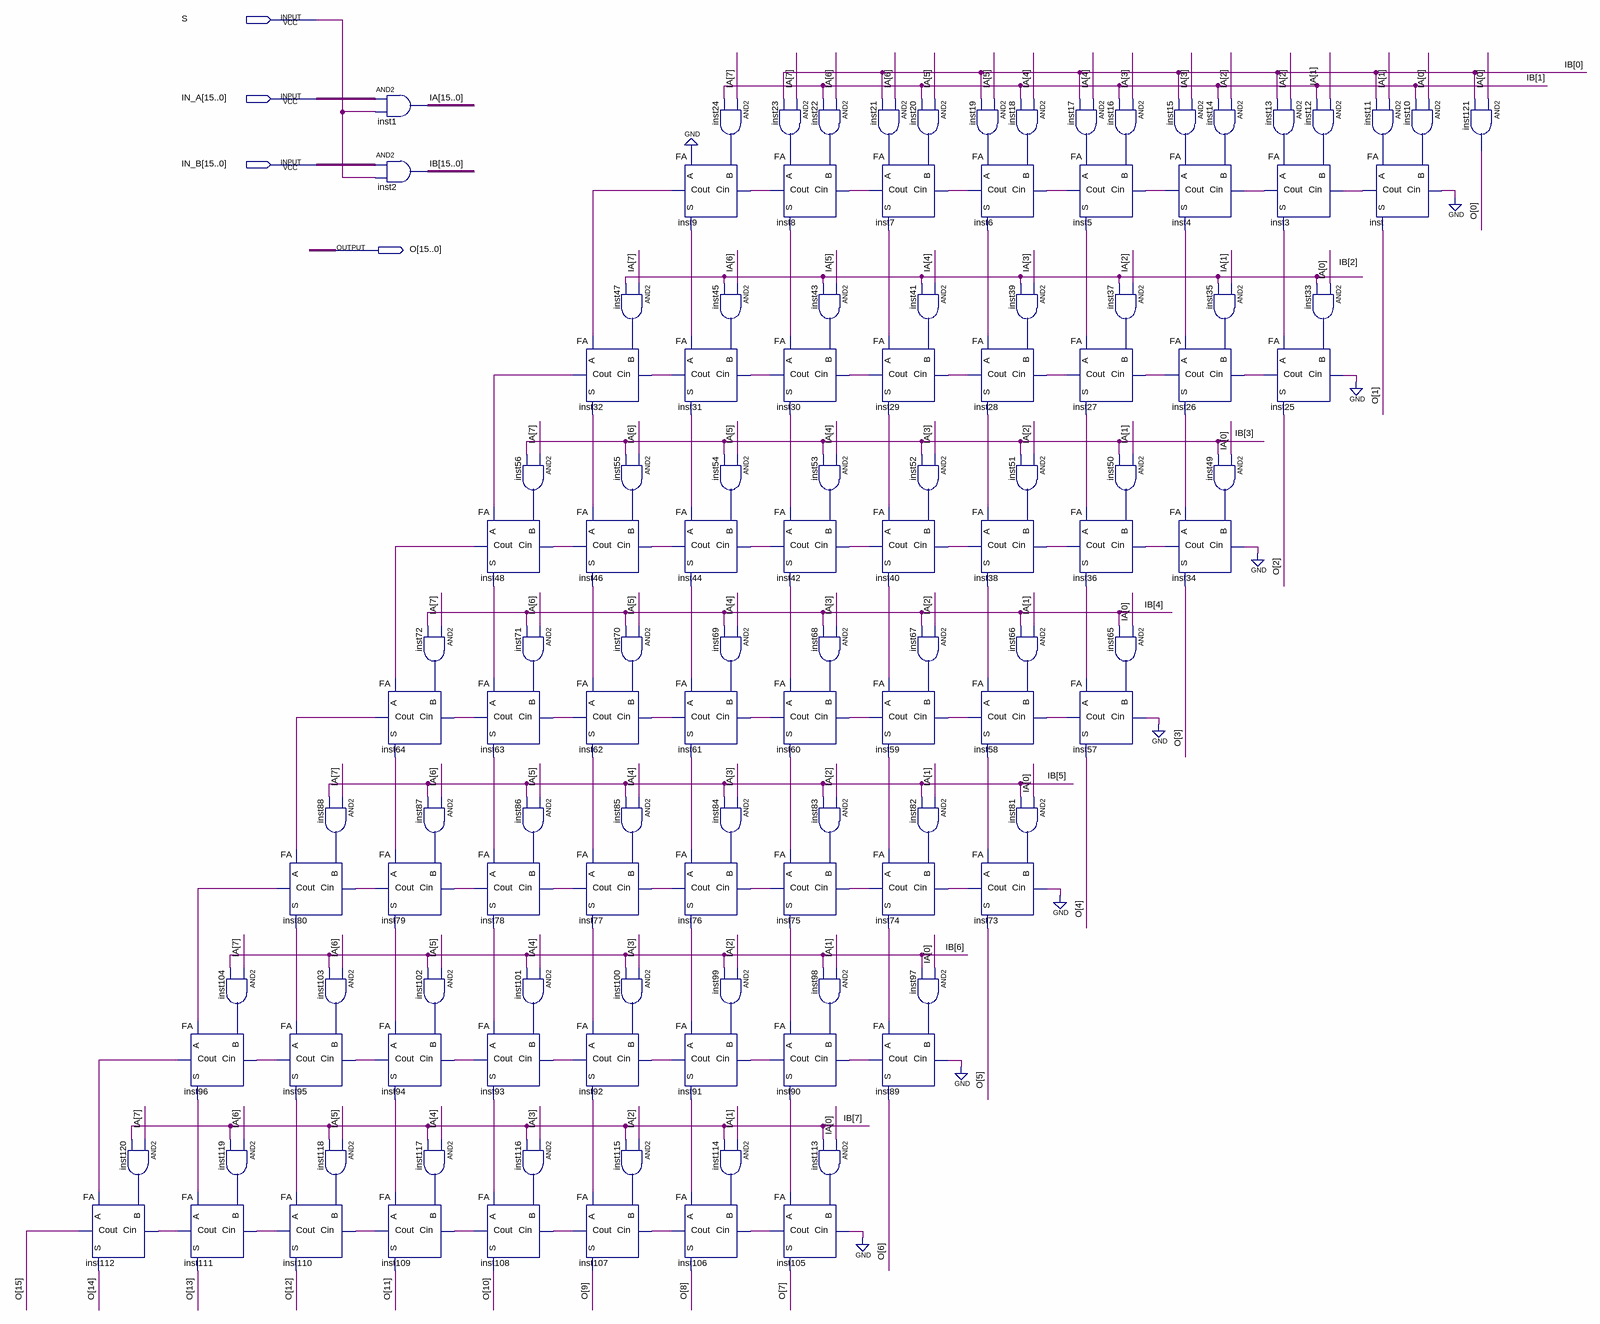
[diagram p0: schematic sheet]
// Quartus schematic Multiplier.bdf as structural Verilog: 122 symbols, 4 pins
module Multiplier (
  input  S,
  input  [15:0] IN_A,
  input  [15:0] IN_B,
  output [15:0] O
);

  wire inst3_cout, inst3_s, inst4_cout, inst4_s, inst5_cout, inst5_s, inst6_cout, inst6_s, inst7_cout,
       inst7_s, inst8_cout, inst8_s, inst9_cout, inst9_s, inst10_out, inst11_out, inst12_out, inst13_out,
       inst14_out, inst15_out, inst16_out, inst17_out, inst18_out, inst19_out, inst20_out, inst21_out,
       inst22_out, inst23_out, inst24_out, inst25_cout, inst26_cout, inst26_s, inst27_cout, inst27_s,
       inst28_cout, inst28_s, inst29_cout, inst29_s, inst30_cout, inst30_s, inst31_cout, inst31_s,
       inst32_cout, inst32_s, inst33_out, inst34_cout, inst35_out, inst36_cout, inst36_s, inst37_out,
       inst38_cout, inst38_s, inst39_out, inst40_cout, inst40_s, inst41_out, inst42_cout, inst42_s,
       inst43_out, inst44_cout, inst44_s, inst45_out, inst46_cout, inst46_s, inst47_out, inst48_cout,
       inst48_s, inst49_out, inst50_out, inst51_out, inst52_out, inst53_out, inst54_out, inst55_out,
       inst56_out, inst57_cout, inst58_cout, inst58_s, inst59_cout, inst59_s, inst60_cout, inst60_s,
       inst61_cout, inst61_s, inst62_cout, inst62_s, inst63_cout, inst63_s, inst64_cout, inst64_s,
       inst65_out, inst66_out, inst67_out, inst68_out, inst69_out, inst70_out, inst71_out, inst72_out,
       inst73_cout, inst74_cout, inst74_s, inst75_cout, inst75_s, inst76_cout, inst76_s, inst77_cout,
       inst77_s, inst78_cout, inst78_s, inst79_cout, inst79_s, inst80_cout, inst80_s, inst81_out, inst82_out,
       inst83_out, inst84_out, inst85_out, inst86_out, inst87_out, inst88_out, inst89_cout, inst90_cout,
       inst90_s, inst91_cout, inst91_s, inst92_cout, inst92_s, inst93_cout, inst93_s, inst94_cout, inst94_s,
       inst95_cout, inst95_s, inst96_cout, inst96_s, inst97_out, inst98_out, inst99_out, inst100_out,
       inst101_out, inst102_out, inst103_out, inst104_out, inst105_cout, inst106_cout, inst107_cout,
       inst108_cout, inst109_cout, inst110_cout, inst111_cout, inst113_out, inst114_out, inst115_out,
       inst116_out, inst117_out, inst118_out, inst119_out, inst120_out, inst_cout;
  wire [15:0] IA, IB;

  and inst120 (inst120_out, IA[7], IB[7]);
  FA inst112 (.A(inst96_cout), .B(inst120_out), .Cin(inst111_cout), .S(O[14]), .Cout(O[15]));
  and inst104 (inst104_out, IA[7], IB[6]);
  FA inst96 (.A(inst80_cout), .B(inst104_out), .Cin(inst95_cout), .S(inst96_s), .Cout(inst96_cout));
  and inst119 (inst119_out, IA[6], IB[7]);
  FA inst111 (.A(inst96_s), .B(inst119_out), .Cin(inst110_cout), .S(O[13]), .Cout(inst111_cout));
  FA inst80 (.A(inst64_cout), .B(inst88_out), .Cin(inst79_cout), .S(inst80_s), .Cout(inst80_cout));
  FA inst95 (.A(inst80_s), .B(inst103_out), .Cin(inst94_cout), .S(inst95_s), .Cout(inst95_cout));
  FA inst110 (.A(inst95_s), .B(inst118_out), .Cin(inst109_cout), .S(O[12]), .Cout(inst110_cout));
  and inst88 (inst88_out, IA[7], IB[5]);
  and inst103 (inst103_out, IA[6], IB[6]);
  and inst118 (inst118_out, IA[5], IB[7]);
  assign IA = IN_A & {16{S}};  // AND2 inst1, 16 bits wide
  assign IB = IN_B & {16{S}};  // AND2 inst2, 16 bits wide
  FA inst64 (.A(inst48_cout), .B(inst72_out), .Cin(inst63_cout), .S(inst64_s), .Cout(inst64_cout));
  FA inst79 (.A(inst64_s), .B(inst87_out), .Cin(inst78_cout), .S(inst79_s), .Cout(inst79_cout));
  FA inst94 (.A(inst79_s), .B(inst102_out), .Cin(inst93_cout), .S(inst94_s), .Cout(inst94_cout));
  FA inst109 (.A(inst94_s), .B(inst117_out), .Cin(inst108_cout), .S(O[11]), .Cout(inst109_cout));
  and inst72 (inst72_out, IA[7], IB[4]);
  and inst87 (inst87_out, IA[6], IB[5]);
  and inst102 (inst102_out, IA[5], IB[6]);
  and inst117 (inst117_out, IA[4], IB[7]);
  FA inst48 (.A(inst32_cout), .B(inst56_out), .Cin(inst46_cout), .S(inst48_s), .Cout(inst48_cout));
  FA inst63 (.A(inst48_s), .B(inst71_out), .Cin(inst62_cout), .S(inst63_s), .Cout(inst63_cout));
  FA inst78 (.A(inst63_s), .B(inst86_out), .Cin(inst77_cout), .S(inst78_s), .Cout(inst78_cout));
  FA inst93 (.A(inst78_s), .B(inst101_out), .Cin(inst92_cout), .S(inst93_s), .Cout(inst93_cout));
  FA inst108 (.A(inst93_s), .B(inst116_out), .Cin(inst107_cout), .S(O[10]), .Cout(inst108_cout));
  and inst56 (inst56_out, IA[7], IB[3]);
  and inst71 (inst71_out, IA[6], IB[4]);
  and inst86 (inst86_out, IA[5], IB[5]);
  and inst101 (inst101_out, IA[4], IB[6]);
  and inst116 (inst116_out, IA[3], IB[7]);
  FA inst32 (.A(inst9_cout), .B(inst47_out), .Cin(inst31_cout), .S(inst32_s), .Cout(inst32_cout));
  FA inst46 (.A(inst32_s), .B(inst55_out), .Cin(inst44_cout), .S(inst46_s), .Cout(inst46_cout));
  FA inst62 (.A(inst46_s), .B(inst70_out), .Cin(inst61_cout), .S(inst62_s), .Cout(inst62_cout));
  FA inst77 (.A(inst62_s), .B(inst85_out), .Cin(inst76_cout), .S(inst77_s), .Cout(inst77_cout));
  FA inst92 (.A(inst77_s), .B(inst100_out), .Cin(inst91_cout), .S(inst92_s), .Cout(inst92_cout));
  FA inst107 (.A(inst92_s), .B(inst115_out), .Cin(inst106_cout), .S(O[9]), .Cout(inst107_cout));
  and inst47 (inst47_out, IA[7], IB[2]);
  and inst55 (inst55_out, IA[6], IB[3]);
  and inst70 (inst70_out, IA[5], IB[4]);
  and inst85 (inst85_out, IA[4], IB[5]);
  and inst100 (inst100_out, IA[3], IB[6]);
  and inst115 (inst115_out, IA[2], IB[7]);
  FA inst9 (.A(1'b0), .B(inst24_out), .Cin(inst8_cout), .S(inst9_s), .Cout(inst9_cout));
  FA inst31 (.A(inst9_s), .B(inst45_out), .Cin(inst30_cout), .S(inst31_s), .Cout(inst31_cout));
  FA inst44 (.A(inst31_s), .B(inst54_out), .Cin(inst42_cout), .S(inst44_s), .Cout(inst44_cout));
  FA inst61 (.A(inst44_s), .B(inst69_out), .Cin(inst60_cout), .S(inst61_s), .Cout(inst61_cout));
  FA inst76 (.A(inst61_s), .B(inst84_out), .Cin(inst75_cout), .S(inst76_s), .Cout(inst76_cout));
  FA inst91 (.A(inst76_s), .B(inst99_out), .Cin(inst90_cout), .S(inst91_s), .Cout(inst91_cout));
  FA inst106 (.A(inst91_s), .B(inst114_out), .Cin(inst105_cout), .S(O[8]), .Cout(inst106_cout));
  and inst24 (inst24_out, IA[7], IB[1]);
  and inst45 (inst45_out, IA[6], IB[2]);
  and inst54 (inst54_out, IA[5], IB[3]);
  and inst69 (inst69_out, IA[4], IB[4]);
  and inst84 (inst84_out, IA[3], IB[5]);
  and inst99 (inst99_out, IA[2], IB[6]);
  and inst114 (inst114_out, IA[1], IB[7]);
  and inst23 (inst23_out, IA[7], IB[0]);
  FA inst8 (.A(inst23_out), .B(inst22_out), .Cin(inst7_cout), .S(inst8_s), .Cout(inst8_cout));
  FA inst30 (.A(inst8_s), .B(inst43_out), .Cin(inst29_cout), .S(inst30_s), .Cout(inst30_cout));
  FA inst42 (.A(inst30_s), .B(inst53_out), .Cin(inst40_cout), .S(inst42_s), .Cout(inst42_cout));
  FA inst60 (.A(inst42_s), .B(inst68_out), .Cin(inst59_cout), .S(inst60_s), .Cout(inst60_cout));
  FA inst75 (.A(inst60_s), .B(inst83_out), .Cin(inst74_cout), .S(inst75_s), .Cout(inst75_cout));
  FA inst90 (.A(inst75_s), .B(inst98_out), .Cin(inst89_cout), .S(inst90_s), .Cout(inst90_cout));
  FA inst105 (.A(inst90_s), .B(inst113_out), .Cin(1'b0), .S(O[7]), .Cout(inst105_cout));
  and inst22 (inst22_out, IA[6], IB[1]);
  and inst43 (inst43_out, IA[5], IB[2]);
  and inst53 (inst53_out, IA[4], IB[3]);
  and inst68 (inst68_out, IA[3], IB[4]);
  and inst83 (inst83_out, IA[2], IB[5]);
  and inst98 (inst98_out, IA[1], IB[6]);
  and inst113 (inst113_out, IA[0], IB[7]);
  and inst20 (inst20_out, IA[5], IB[1]);
  and inst21 (inst21_out, IA[6], IB[0]);
  FA inst7 (.A(inst21_out), .B(inst20_out), .Cin(inst6_cout), .S(inst7_s), .Cout(inst7_cout));
  and inst41 (inst41_out, IA[4], IB[2]);
  FA inst29 (.A(inst7_s), .B(inst41_out), .Cin(inst28_cout), .S(inst29_s), .Cout(inst29_cout));
  and inst52 (inst52_out, IA[3], IB[3]);
  FA inst40 (.A(inst29_s), .B(inst52_out), .Cin(inst38_cout), .S(inst40_s), .Cout(inst40_cout));
  and inst67 (inst67_out, IA[2], IB[4]);
  FA inst59 (.A(inst40_s), .B(inst67_out), .Cin(inst58_cout), .S(inst59_s), .Cout(inst59_cout));
  and inst82 (inst82_out, IA[1], IB[5]);
  FA inst74 (.A(inst59_s), .B(inst82_out), .Cin(inst73_cout), .S(inst74_s), .Cout(inst74_cout));
  and inst97 (inst97_out, IA[0], IB[6]);
  FA inst89 (.A(inst74_s), .B(inst97_out), .Cin(1'b0), .S(O[6]), .Cout(inst89_cout));
  and inst18 (inst18_out, IA[4], IB[1]);
  and inst19 (inst19_out, IA[5], IB[0]);
  FA inst6 (.A(inst19_out), .B(inst18_out), .Cin(inst5_cout), .S(inst6_s), .Cout(inst6_cout));
  and inst39 (inst39_out, IA[3], IB[2]);
  FA inst28 (.A(inst6_s), .B(inst39_out), .Cin(inst27_cout), .S(inst28_s), .Cout(inst28_cout));
  and inst51 (inst51_out, IA[2], IB[3]);
  FA inst38 (.A(inst28_s), .B(inst51_out), .Cin(inst36_cout), .S(inst38_s), .Cout(inst38_cout));
  and inst66 (inst66_out, IA[1], IB[4]);
  FA inst58 (.A(inst38_s), .B(inst66_out), .Cin(inst57_cout), .S(inst58_s), .Cout(inst58_cout));
  and inst81 (inst81_out, IA[0], IB[5]);
  FA inst73 (.A(inst58_s), .B(inst81_out), .Cin(1'b0), .S(O[5]), .Cout(inst73_cout));
  and inst17 (inst17_out, IA[4], IB[0]);
  FA inst5 (.A(inst17_out), .B(inst16_out), .Cin(inst4_cout), .S(inst5_s), .Cout(inst5_cout));
  FA inst27 (.A(inst5_s), .B(inst37_out), .Cin(inst26_cout), .S(inst27_s), .Cout(inst27_cout));
  FA inst36 (.A(inst27_s), .B(inst50_out), .Cin(inst34_cout), .S(inst36_s), .Cout(inst36_cout));
  FA inst57 (.A(inst36_s), .B(inst65_out), .Cin(1'b0), .S(O[4]), .Cout(inst57_cout));
  and inst16 (inst16_out, IA[3], IB[1]);
  and inst37 (inst37_out, IA[2], IB[2]);
  and inst50 (inst50_out, IA[1], IB[3]);
  and inst65 (inst65_out, IA[0], IB[4]);
  and inst15 (inst15_out, IA[3], IB[0]);
  FA inst4 (.A(inst15_out), .B(inst14_out), .Cin(inst3_cout), .S(inst4_s), .Cout(inst4_cout));
  FA inst26 (.A(inst4_s), .B(inst35_out), .Cin(inst25_cout), .S(inst26_s), .Cout(inst26_cout));
  FA inst34 (.A(inst26_s), .B(inst49_out), .Cin(1'b0), .S(O[3]), .Cout(inst34_cout));
  and inst14 (inst14_out, IA[2], IB[1]);
  and inst35 (inst35_out, IA[1], IB[2]);
  and inst49 (inst49_out, IA[0], IB[3]);
  and inst13 (inst13_out, IA[2], IB[0]);
  FA inst3 (.A(inst13_out), .B(inst12_out), .Cin(inst_cout), .S(inst3_s), .Cout(inst3_cout));
  FA inst25 (.A(inst3_s), .B(inst33_out), .Cin(1'b0), .S(O[2]), .Cout(inst25_cout));
  and inst12 (inst12_out, IA[1], IB[1]);
  and inst33 (inst33_out, IA[0], IB[2]);
  and inst11 (inst11_out, IA[1], IB[0]);
  FA inst (.A(inst11_out), .B(inst10_out), .Cin(1'b0), .S(O[1]), .Cout(inst_cout));
  and inst10 (inst10_out, IA[0], IB[1]);
  and inst121 (O[0], IA[0], IB[0]);
endmodule
